# Altium schematic sheet Motor Controller.SchDoc
size A
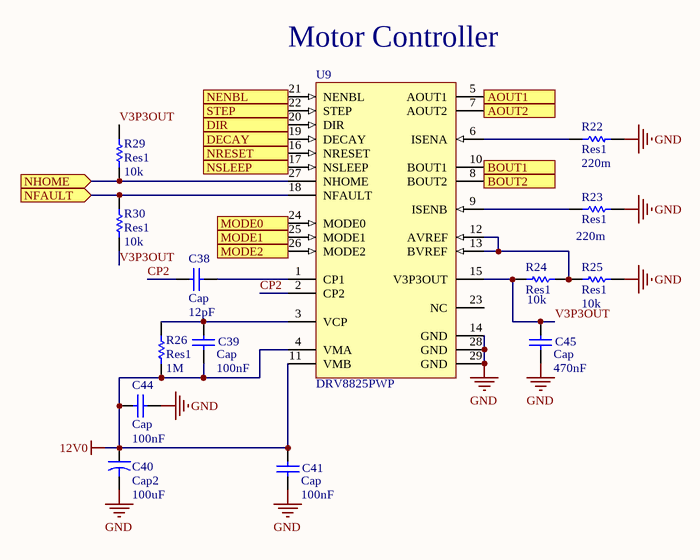
[diagram p0: Motor Controller.SchDoc]

## Parts
C38  Cap  value 12pF  [0402-A]
C39  Cap  value 100nF  [1608[0603]]
C40  Cap2  value 100uF  [RAD-0.1]
C41  Cap  value 100nF  [1608[0603]]
C44  Cap  value 100nF  [1608[0603]]
C45  Cap  value 470nF  [1608[0603]]
R22  Res1  value 220m  [RC2512N_PAN]
R23  Res1  value 220m  [RC2512N_PAN]
R24  Res1  value 10k  [0402-A]
R25  Res1  value 10k  [0402-A]
R26  Res1  value 1M  [0402-A]
R29  Res1  value 10k  [0402-A]
R30  Res1  value 10k  [0402-A]
U9  DRV8825PWP  [PWP0028C_L]

## Ports
AOUT1 (out), AOUT2 (out), BOUT1 (out), BOUT2 (out), DECAY (in), DIR (in), MODE0 (in), MODE1 (in), MODE2 (in), NENBL (in), NFAULT (in), NHOME (in), NRESET (in), NSLEEP (in), STEP (in)

## Nets
12V0: C39.1 C40.1 C41.2 C44.2 R26.1 U9.4(VMA) U9.11(VMB)
GND: C40.2 C41.1 C44.1 C45.1 R22.1 R23.1 R25.2 U9.14(GND) U9.28(GND) U9.29(GND)
AOUT1: U9.5(AOUT1) ; port AOUT1
AOUT2: U9.7(AOUT2) ; port AOUT2
BOUT1: U9.10(BOUT1) ; port BOUT1
BOUT2: U9.8(BOUT2) ; port BOUT2
CP2: C38.2 U9.2(CP2)
DECAY: U9.19(DECAY) ; port DECAY
DIR: U9.20(DIR) ; port DIR
MODE0: U9.24(MODE0) ; port MODE0
MODE1: U9.25(MODE1) ; port MODE1
MODE2: U9.26(MODE2) ; port MODE2
NENBL: U9.21(NENBL) ; port NENBL
NFAULT: R30.2 U9.18(NFAULT) ; port NFAULT
NHOME: R29.2 U9.27(NHOME) ; port NHOME
NRESET: U9.16(NRESET) ; port NRESET
NSLEEP: U9.17(NSLEEP) ; port NSLEEP
STEP: U9.22(STEP) ; port STEP
V3P3OUT: C45.2 R24.2 R29.1 R30.1 U9.15(V3P3OUT)
NetC38_1: C38.1 U9.1(CP1)
NetC39_2: C39.2 R26.2 U9.3(VCP)
NetR22_2: R22.2 U9.6(ISENA)
NetR23_2: R23.2 U9.9(ISENB)
NetR24_1: R24.1 R25.1 U9.12(AVREF) U9.13(BVREF)

Not connected (* = marked no-connect by the designer): U9 23(NC)

## Notes on the sheet
- (near U9) Motor Controller

## Library data of the parts
C38 C39 C41 C44 C45 = Cap: Capacitor; Published: 8-Jun-2000; LatestRevisionDate: 17-Jul-2002; LatestRevisionNote: Re-released for DXP Platform.; PackageReference: RAD-0.3; Publisher: Altium Limited; PackageDescription: Radial Cap, Thru-Hole; 2 Leads; 0.3 in Pin Spacing
C40 = Cap2: Capacitor; Published: 23-Sep-2002; PackageReference: CAPR5-4X5; Publisher: Altium Limited; PackageDescription: Capacitor; 2 Leads
R22-R26 R29 R30 = Res1: Resistor; Published: 8-Jun-2000; LatestRevisionDate: 17-Jul-2002; LatestRevisionNote: Re-released for DXP Platform.; PackageReference: AXIAL-0.3; Publisher: Altium Limited; PackageDescription: Axial Device, Thru-Hole; 2 Leads; 0.3 in Pin Spacing
U9 = CMP-1685-00019-1: Stepper Motor Controller IC, 8.2 to 45 V, -40 to 85 degC, 28-Pin HTSSOP (PWP), Green (RoHS & no Sb/Br), Tube; Voltage Rating: 100 V; Tolerance: 20%; Capacitance: 47 uF; Case\Package: Radial; ComponentLink2URL: http://www.ti.com/general/docs/lit/getliterature.tsp?genericPartNumber=DRV8825&fileType=pdf; Voltage Rating (DC): 100 V; Lead Pitch: 3.5 mm; Diameter: 8 mm; DatasheetVersion: SLVSA73F, 07/2014; ComponentLink2Description: Datasheet; Package Quantity: 200; PackageDescription: 28-Pin Small Outline Package Integrated Circuit, Body 9.7 x 4.4 mm, Pitch 0.65 mm; Packaging: Bulk; Pins: 2; Min Operating Temperature: -40 degC; Width: 8 mm; ComponentLink1Description: Manufacturer URL; Length: 11.5 mm; Max Operating Temperature: 85 degC; Height: 11.5 mm; REACH SVHC: No SVHC; Mount: Through Hole; PackageReference: PWP0028C; RoHSCompliant: true; Radiation Hardening: No; ComponentLink1URL: http://www.ti.com/